# Altium schematic sheet buck.SchDoc
size A3; SheetNumber: 6; SheetTotal: 6
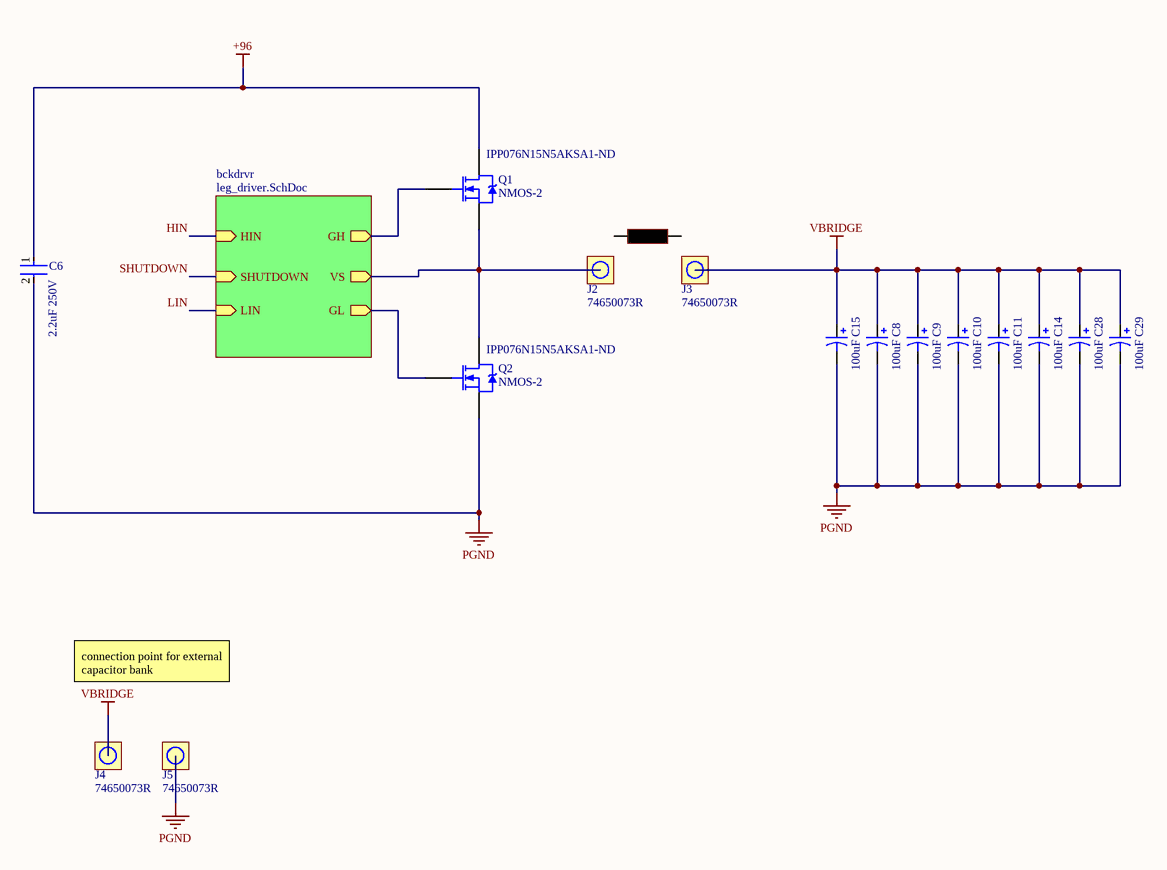
[diagram p0: buck.SchDoc]

## Parts
C6  2.2uF 250V  [FP-CGA9P-IPC_B]
C8  100uF  [electrolyte_10mm_5mm]
C9  100uF  [electrolyte_10mm_5mm]
C10  100uF  [electrolyte_10mm_5mm]
C11  100uF  [electrolyte_10mm_5mm]
C14  100uF  [electrolyte_10mm_5mm]
C15  100uF  [electrolyte_10mm_5mm]
C28  100uF  [electrolyte_10mm_5mm]
C29  100uF  [electrolyte_10mm_5mm]
J2  74650073R  [screw_terminal]
J3  74650073R  [screw_terminal]
J4  74650073R  [screw_terminal]
J5  74650073R  [screw_terminal]
Q1  NMOS-2  Supplier Part Number 1: IPP076N15N5AKSA1-ND  [TO-220AB]
Q2  NMOS-2  Supplier Part Number 1: IPP076N15N5AKSA1-ND  [TO-220AB]

## Sub-sheets
bckdrvr = leg_driver.SchDoc: GH (out), HIN (in), LIN (in), SHUTDOWN (in), GL (out), VS (out)

## Nets
+96: C6.1 Q1.2(D)
PGND: C6.2 C8.2 C9.2 C10.2 C11.2 C14.2 C15.2 C28.2 C29.2 J5.1 Q2.3(S)
VBRIDGE: C8.1 C9.1 C10.1 C11.1 C14.1 C15.1 C28.1 C29.1 J3.1 J4.1
HIN: sheet bckdrvr/HIN
LIN: sheet bckdrvr/LIN
SHUTDOWN: sheet bckdrvr/SHUTDOWN
NetJ2_1: J2.1 Q1.3(S) Q2.2(D) ; sheet bckdrvr/VS
NetQ1_1: Q1.1(G) ; sheet bckdrvr/GH
NetQ2_1: Q2.1(G) ; sheet bckdrvr/GL

## Notes on the sheet
- connection point for external capacitor bank
- 1
- 2
- 3
- 4
- 5
- 6
- 7
- 8
- A
- B
- C
- D
- Project:
- Date:
- Drawing number:
- Rev:
- Format:
- A3
- Drawn by:
- Laboratory:
- Page
- Sheet:
- of
- File:

## Library data of the parts
C6 = CMP-08246-001668-1: Cap Ceramic 2.2uF 250V X7T 20% Pad SMD 2220 +125°C Automotive T/R / CGA9P3X7T2E225M250KE; Weight: 0.016932oz; Width: 0.197inch; Depth: 5mm; Termination: SMD/SMT; Capacitance: 2.2uF; Voltage Rating (DC): 250V; Dielectric: X7T; Case/Package: 2220; Package Quantity: 500; Height: 2.5mm; Min Operating Temperature: -55°C; Case Code (Metric): 5750; Features: Soft Termination; Max Operating Temperature: 125°C; Ratings: AEC-Q200; Thickness: 0.098inch; Length: 5.7mm; Mount: Surface Mount; Tolerance: 20%; Voltage Rating: 250V; Case Code (Imperial): 2220; Packaging: Tape and Reel
C8-C11 C14 C15 C28 C29 = Cap Pol1: Polarized Capacitor (Radial); Published: 8-Jun-2000; LatestRevisionDate: 17-Jul-2002; LatestRevisionNote: Re-released for DXP Platform.; PackageReference: RB7.6-15; Publisher: Altium Limited; PackageDescription: Polarized Capacitor (Radial); 2 Leads
J2-J5 = screw_socket: 74650073R 50A; Supplier 1: Digi-Key; Supplier Part Number 1: 732-10882-1-ND
Q1 Q2 = NMOS-2: N-Channel Power MOSFET; Note: Pin 2 is electrically connected to pin 4.; Published: 8-Jun-2000; LatestRevisionDate: 17-Jul-2002; LatestRevisionNote: Re-released for DXP Platform.; DatasheetVersion: PD-9.814; PackageVersion: Feb-1997; PackageReference: TO-220AB; Publisher: Altium Limited; PackageDescription: TO, Thru-Hole, Vertical, Heatsink Mounted; 3 In-Line Leads; Pitch 2.54 mm; ComponentLink1Description: Manufacturer Link; ComponentLink1URL: http://www.irf.com/; Supplier 1: Digi-Key